# Altium schematic sheet CAN_PHY.SchDoc
size A4; SheetNumber: 6; SheetTotal: 8
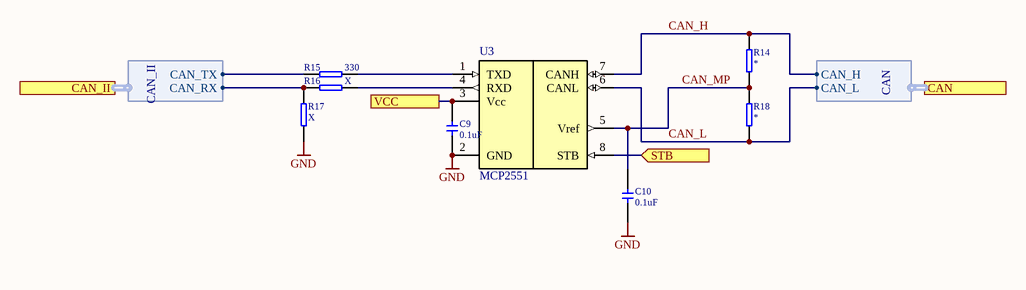
[diagram p0: CAN_PHY.SchDoc]

## Parts
C9  value 0.1uF  [CERCAP 0603]
C10  value 0.1uF  [CERCAP 0603]
R14  (no value)  [RES 0603]
R15  value 330  [RES 0603]
R16  value X  [RES 0603]
R17  value X  [RES 0603]
R18  (no value)  [RES 0603]
U3  MCP2551  [SO-8]

## Ports
CAN (harness CAN), CAN_II (harness CAN_II), STB (in), VCC

## Harnesses
CAN: CAN_H, CAN_L
CAN_II: CAN_RX, CAN_TX

## Nets
GND: C9.1 C10.1 R17.1 U3.2(GND)
CAN_H: R14.2 U3.7(CANH) ; port CAN.CAN_H
CAN_L: R18.1 U3.6(CANL) ; port CAN.CAN_L
CAN_MP: C10.2 R14.1 R18.2 U3.5(Vref)
STB: U3.8(STB) ; port STB
VCC: C9.2 U3.3(Vcc) ; port VCC
NetR15_1: R15.1 ; port CAN_II.CAN_TX
NetR15_2: R15.2 U3.1(TXD)
NetR16_1: R16.1 R17.2 ; port CAN_II.CAN_RX
NetR16_2: R16.2 U3.4(RXD)

## Library data of the parts
C9 C10 = !Capacitor: Capacitor; IsSMT: NoSMT; Diel: X7R; Voltage: *
R14-R18 = !Resistor: Resistor; IsSMT: NoSMT
  R14 R18: Value: *
U3 = CAN_PHY: CAN PHY